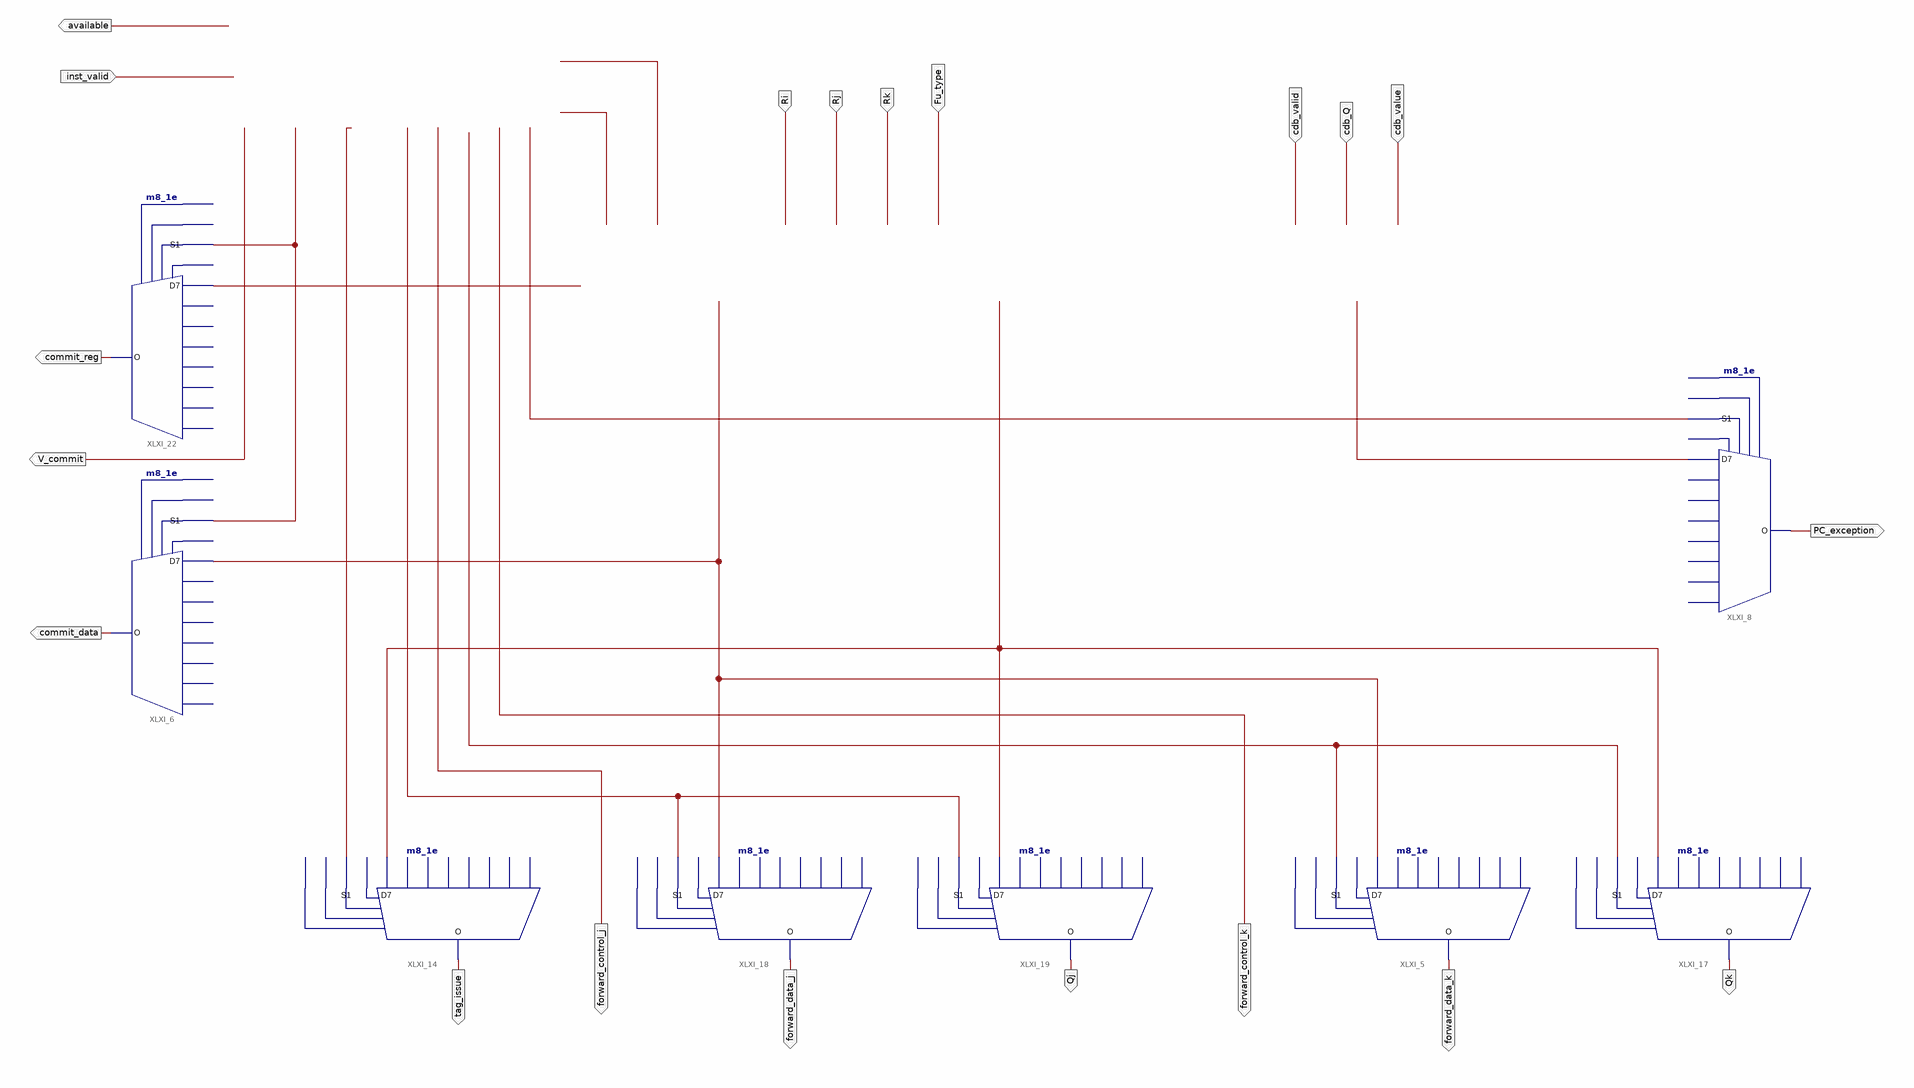
[diagram p0: schematic sheet 1]
// Xilinx ISE schematic reorder_buffer.sch (spartan3e) as structural Verilog: 8 symbols, 20 ports
module reorder_buffer (
  input  Ri,
  input  Fu_type,
  input  Rj,
  input  cdb_valid,
  input  cdb_Q,
  input  cdb_value,
  input  Rk,
  input  inst_valid,
  output available,
  output commit_data,
  output commit_reg,
  output PC_exception,
  output V_commit,
  output Qk,
  output forward_data_k,
  output forward_data_j,
  output Qj,
  output tag_issue,
  output forward_control_j,
  output forward_control_k
);

  wire XLXN_1, XLXN_2, XLXN_4, XLXN_5, XLXN_7, XLXN_8, XLXN_9, XLXN_13, XLXN_14;

  m8_1e XLXI_6 (.D7(XLXN_2), .S1(XLXN_7), .O(commit_data));  // open: D0, D1, D2, D3, D4, D5, D6, E, S0, S2
  m8_1e XLXI_8 (.D7(XLXN_9), .S1(XLXN_14), .O(PC_exception));  // open: D0, D1, D2, D3, D4, D5, D6, E, S0, S2
  m8_1e XLXI_22 (.D7(XLXN_8), .S1(XLXN_7), .O(commit_reg));  // open: D0, D1, D2, D3, D4, D5, D6, E, S0, S2
  m8_1e XLXI_17 (.D7(XLXN_4), .S1(XLXN_5), .O(Qk));  // open: D0, D1, D2, D3, D4, D5, D6, E, S0, S2
  m8_1e XLXI_5 (.D7(XLXN_2), .S1(XLXN_5), .O(forward_data_k));  // open: D0, D1, D2, D3, D4, D5, D6, E, S0, S2
  m8_1e XLXI_18 (.D7(XLXN_2), .S1(XLXN_1), .O(forward_data_j));  // open: D0, D1, D2, D3, D4, D5, D6, E, S0, S2
  m8_1e XLXI_19 (.D7(XLXN_4), .S1(XLXN_1), .O(Qj));  // open: D0, D1, D2, D3, D4, D5, D6, E, S0, S2
  m8_1e XLXI_14 (.D7(XLXN_4), .S1(XLXN_13), .O(tag_issue));  // open: D0, D1, D2, D3, D4, D5, D6, E, S0, S2
endmodule
